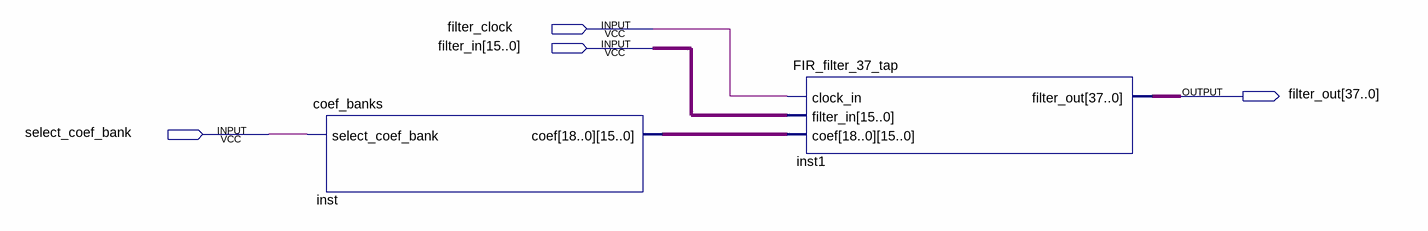
[diagram p0: schematic sheet]
// Quartus schematic 37_tap_FIR_filter.bdf as structural Verilog: 2 symbols, 4 pins
module \37_tap_FIR_filter  (
  input  filter_clock,
  input  [15:0] filter_in,
  input  select_coef_bank,
  output [37:0] filter_out
);

  wire [303:0] inst_coef;

  coef_banks inst (.select_coef_bank(select_coef_bank), .coef(inst_coef));
  FIR_filter_37_tap inst1 (.clock_in(filter_clock), .filter_in(filter_in), .coef(inst_coef), .filter_out(filter_out));
endmodule
